# Altium project TMDX654GPEVM.PrjPcb (part 24 of 24)
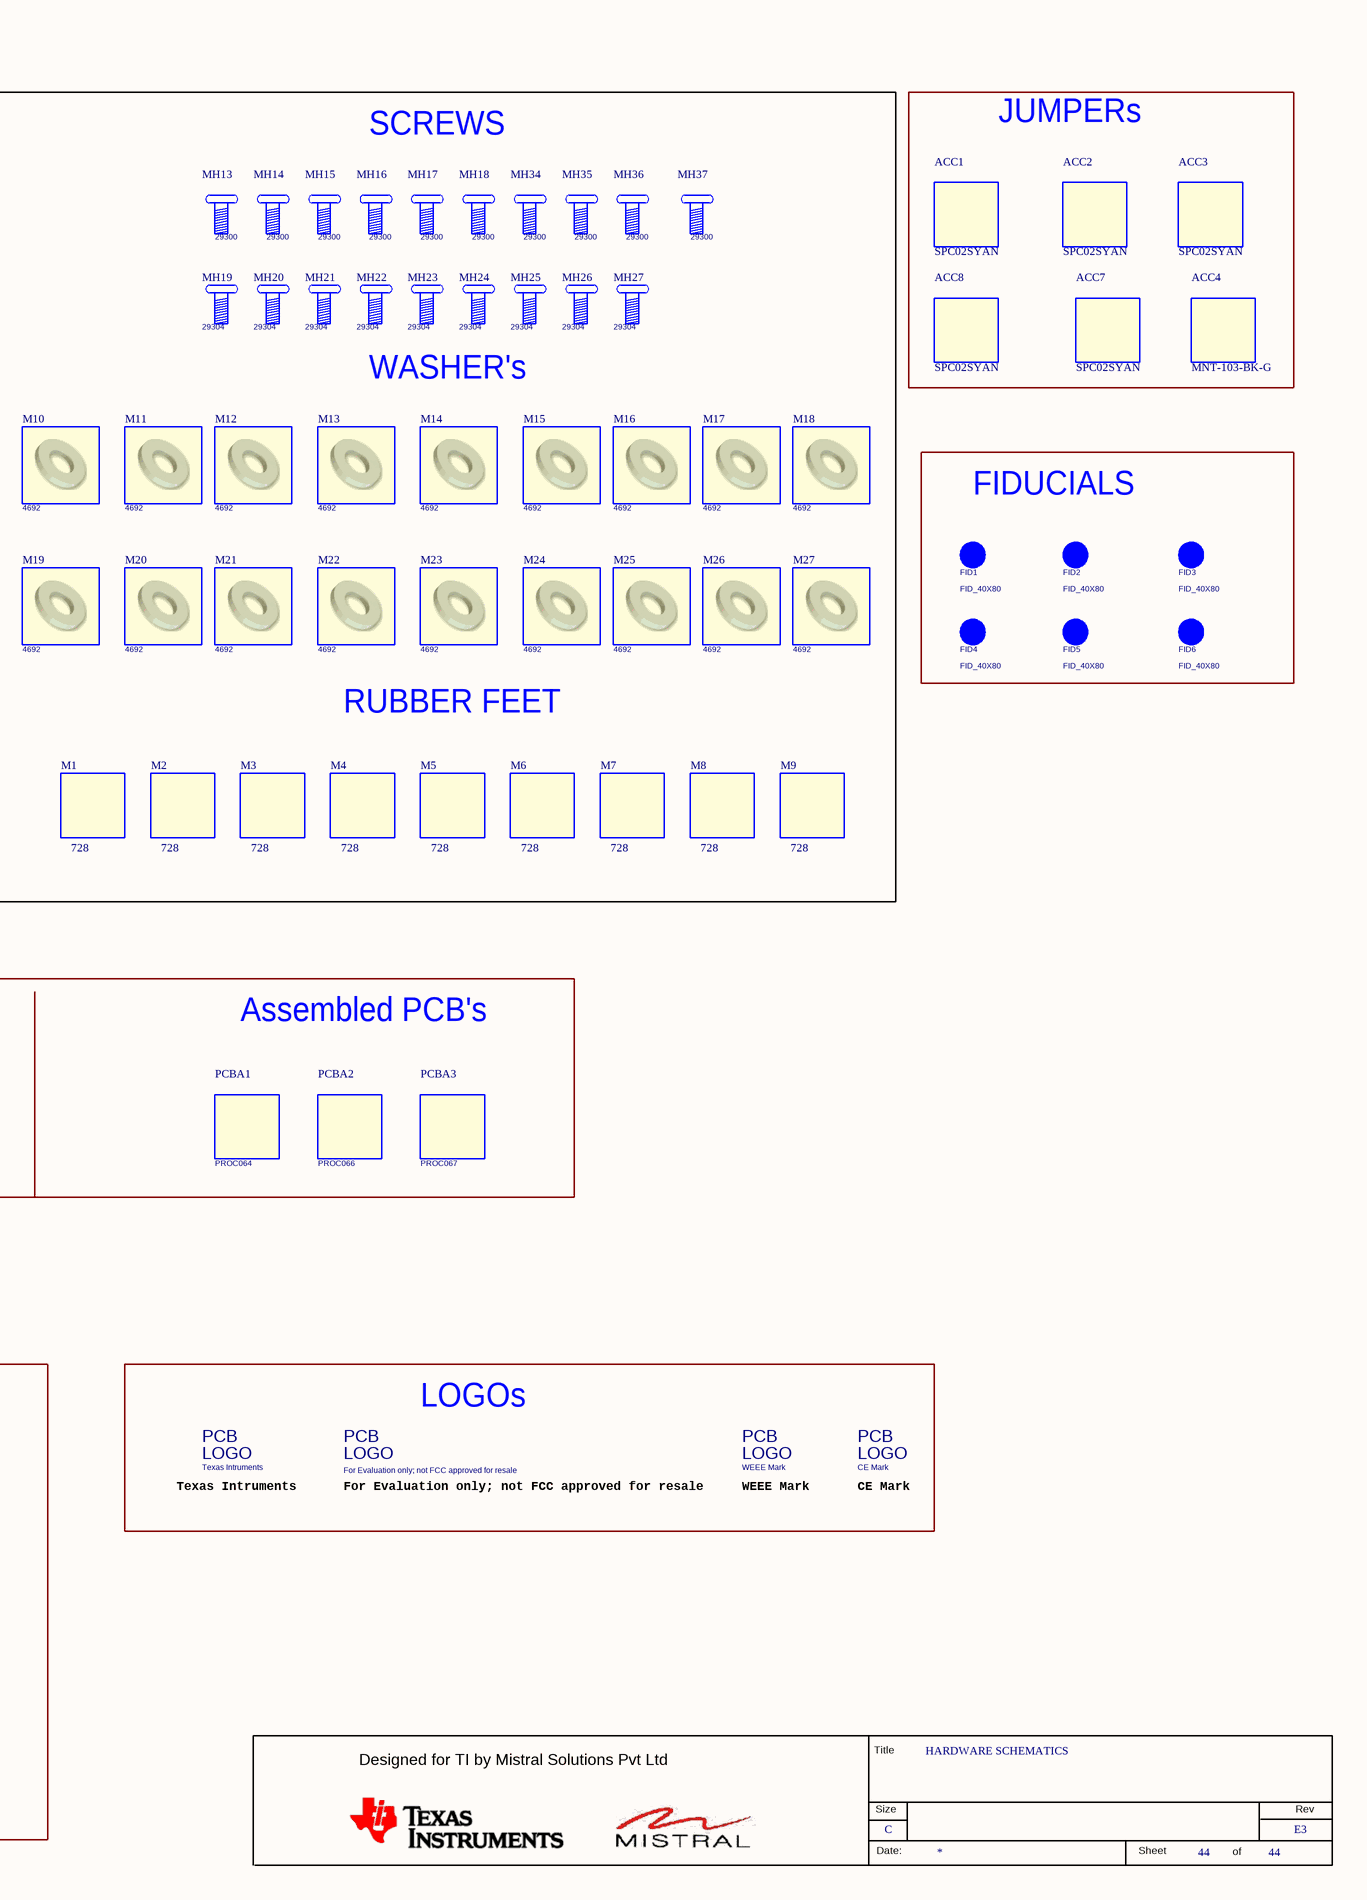
[diagram p84: 44-HARDWARE SCHEMATICS.SchDoc, right]

## Nets that join several sheets
CAP_VDD_WKUP: 11-SoC POWER1 (C115.1 U34.V9), 12-SoC POWER2 (U34.M22 U34.V11 U34.W10 U34.W12), 13-SoC POWER3 (C443.1 C459.1 C475.1 C571.1)
CAP_VDDA_1P8_IOLDO0: 11-SoC POWER1 (C170.2 U34.G19), 12-SoC POWER2 (U34.AA10 U34.AA16 U34.G12 U34.P20)
CAP_VDDA_1P8_IOLDO_WKUP: 11-SoC POWER1 (C113.2 U34.AA8), 12-SoC POWER2 (U34.V8)
CAP_VDDA_1P8_SDIO: 11-SoC POWER1 (C180.1 U34.J17), 12-SoC POWER2 (U34.G17 U34.K20)
CAP_VDDSHV_SDLDO: 11-SoC POWER1 (C541.1 U34.H18), 12-SoC POWER2 (FL20.1)
DDR_VPP: 15-DDR4 DEVICES (20 pins), 16-DDR4 ECC AND TERMINATIONS (6 pins)
DDR_VREFCA: 15-DDR4 DEVICES (12 pins), 16-DDR4 ECC AND TERMINATIONS (C206.1 C597.1 R728.1 U38.J1), 42-PERIPHERAL POWER SUPPLY (C37.1 U10.6)
DGND: 10-SoC CLOCK AND RESET (34 pins), 11-SoC POWER1 (94 pins), 12-SoC POWER2 (R484.2), 13-SoC POWER3 (81 pins), 14-SoC POWER4 (170 pins), 15-DDR4 DEVICES (128 pins), 16-DDR4 ECC AND TERMINATIONS (54 pins), 17-eMMC FLASH_SDCARD INTERFACE (37 pins), 18-OSPI FLASH AND SPI NOR FLASH (14 pins), 19-EEPROM,PRESENCE DETECTION & TEMP SENSOR (26 pins), 20-RGMII ETHERNET PHY - ICSSG PRG2_PRU0 (40 pins), 21-RGMII ETHERNET PHY - ICSSG PRG2_PRU1 (34 pins), 22-RGMII ETHERNET PHY - MCU (48 pins), 23-TEST AUTOMATION (13 pins), 24-BOOT MODE BUFFER AND SWITCHES (54 pins), 25-CURRENT MONITORING DEVICES (31 pins), 26-XDS110 DEBUGGER (57 pins), 27-JTAG BUFFER (32 pins), 28-MIPI 60 PIN CONNECTOR (33 pins), 29-USB 2.0 INTERFACE (17 pins), 30-FT4232 LEVEL TRANSLATOR (51 pins), 31-FT4232 UART TO USB BRIDG (37 pins), 32-APPLICATION BOARD CONNECTOR (74 pins), 33-SOC_GENERAL AND MCU GENERAL (R394.1 R428.2), 34-SERDES AND DISPLAY INTERFACE (62 pins), 35-CSI-GPM-CDSS INTERFACE (75 pins), 36-ETHERNET PHY CLOCK GENERATOR (20 pins), 37-ETHERNET LEDs (23 pins), 38-TEST HEADER (11 pins), 39-VOLTAGE SUPERVISOR AND WKUP LEDs (18 pins), 40-PRE_REG AND SERDES POWER SUPPLY (57 pins), 41-SoC POWER SUPPLY (43 pins), 42-PERIPHERAL POWER SUPPLY (41 pins), 43-OVER VOLTAGE PROTECTION CKT (36 pins)
PRG_EARTH: 20-RGMII ETHERNET PHY - ICSSG PRG2_PRU0 (C489.1 J14.SH1 J14.SH2 R473.1), 21-RGMII ETHERNET PHY - ICSSG PRG2_PRU1 (J14.SH3 J14.SH4)
SOC_DVDD1V8: 12-SoC POWER2 (30 pins), 13-SoC POWER3 (27 pins), 25-CURRENT MONITORING DEVICES (J15.2 R234.3)
SoC_DVDD3V3: 12-SoC POWER2 (21 pins), 13-SoC POWER3 (15 pins), 25-CURRENT MONITORING DEVICES (J31.2 R459.3), 33-SOC_GENERAL AND MCU GENERAL (R395.2)
SoC_MPU: 25-CURRENT MONITORING DEVICES (C278.1 J24.1 R348.4), 41-SoC POWER SUPPLY (C261.1 C266.1 L3.2 TP24.1)
SoC_VDDS_DDR: 11-SoC POWER1 (18 pins), 25-CURRENT MONITORING DEVICES (J29.2 R361.4)
VCC1V0: 25-CURRENT MONITORING DEVICES (6 pins), 41-SoC POWER SUPPLY (9 pins)
VCC1V2_DDR: 25-CURRENT MONITORING DEVICES (6 pins), 41-SoC POWER SUPPLY (5 pins)
VCC1V8: 10-SoC CLOCK AND RESET (6 pins), 17-eMMC FLASH_SDCARD INTERFACE (20 pins), 18-OSPI FLASH AND SPI NOR FLASH (19 pins), 19-EEPROM,PRESENCE DETECTION & TEMP SENSOR (R27.2), 20-RGMII ETHERNET PHY - ICSSG PRG2_PRU0 (22 pins), 21-RGMII ETHERNET PHY - ICSSG PRG2_PRU1 (20 pins), 22-RGMII ETHERNET PHY - MCU (28 pins), 25-CURRENT MONITORING DEVICES (C219.1 J15.1 R234.2), 28-MIPI 60 PIN CONNECTOR (FL5.1), 30-FT4232 LEVEL TRANSLATOR (13 pins), 32-APPLICATION BOARD CONNECTOR (7 pins), 34-SERDES AND DISPLAY INTERFACE (C295.1 C300.1 J6.3), 35-CSI-GPM-CDSS INTERFACE (21 pins), 36-ETHERNET PHY CLOCK GENERATOR (FL4.1), 37-ETHERNET LEDs (C662.1 U109.6), 38-TEST HEADER (6 pins), 41-SoC POWER SUPPLY (5 pins)
VCC3V3_IO: 10-SoC CLOCK AND RESET (11 pins), 17-eMMC FLASH_SDCARD INTERFACE (14 pins), 18-OSPI FLASH AND SPI NOR FLASH (13 pins), 19-EEPROM,PRESENCE DETECTION & TEMP SENSOR (32 pins), 20-RGMII ETHERNET PHY - ICSSG PRG2_PRU0 (R481.2 R482.2 R501.1 R506.2), 21-RGMII ETHERNET PHY - ICSSG PRG2_PRU1 (R178.2 R490.2 R496.1), 22-RGMII ETHERNET PHY - MCU (11 pins), 23-TEST AUTOMATION (14 pins), 24-BOOT MODE BUFFER AND SWITCHES (51 pins), 25-CURRENT MONITORING DEVICES (28 pins), 27-JTAG BUFFER (23 pins), 28-MIPI 60 PIN CONNECTOR (20 pins), 29-USB 2.0 INTERFACE (R37.1), 30-FT4232 LEVEL TRANSLATOR (16 pins), 32-APPLICATION BOARD CONNECTOR (5 pins), 33-SOC_GENERAL AND MCU GENERAL (9 pins), 34-SERDES AND DISPLAY INTERFACE (14 pins), 35-CSI-GPM-CDSS INTERFACE (31 pins), 36-ETHERNET PHY CLOCK GENERATOR (FL3.1), 37-ETHERNET LEDs (20 pins), 38-TEST HEADER (C221.1 R270.2 U45.7), 39-VOLTAGE SUPERVISOR AND WKUP LEDs (5 pins), 41-SoC POWER SUPPLY (R336.2), 42-PERIPHERAL POWER SUPPLY (6 pins)
VCC3V3_PREREG: 12-SoC POWER2 (R486.1), 39-VOLTAGE SUPERVISOR AND WKUP LEDs (C231.1 U49.6), 40-PRE_REG AND SERDES POWER SUPPLY (8 pins), 41-SoC POWER SUPPLY (21 pins), 42-PERIPHERAL POWER SUPPLY (17 pins)
VCC3V3_XDS: 26-XDS110 DEBUGGER (40 pins), 27-JTAG BUFFER (6 pins)
VCC_2V5: 16-DDR4 ECC AND TERMINATIONS (FL1.1), 34-SERDES AND DISPLAY INTERFACE (C297.1 C298.1 J6.1), 42-PERIPHERAL POWER SUPPLY (C17.1 TP82.1 U5.1)
VCC_3V3_FT4232: 30-FT4232 LEVEL TRANSLATOR (8 pins), 31-FT4232 UART TO USB BRIDG (19 pins)
VCC_5V0: 29-USB 2.0 INTERFACE (C50.1 FL2.1), 32-APPLICATION BOARD CONNECTOR (5 pins), 34-SERDES AND DISPLAY INTERFACE (9 pins), 35-CSI-GPM-CDSS INTERFACE (8 pins), 40-PRE_REG AND SERDES POWER SUPPLY (8 pins)
VCC_12V0: 34-SERDES AND DISPLAY INTERFACE (C296.1 C301.1 J6.7 J6.9), 40-PRE_REG AND SERDES POWER SUPPLY (14 pins), 43-OVER VOLTAGE PROTECTION CKT (C336.1 J9.2)
VDD_1V0: 20-RGMII ETHERNET PHY - ICSSG PRG2_PRU0 (13 pins), 21-RGMII ETHERNET PHY - ICSSG PRG2_PRU1 (13 pins), 22-RGMII ETHERNET PHY - MCU (13 pins), 32-APPLICATION BOARD CONNECTOR (C215.1 J16.56 J16.58 J16.60), 34-SERDES AND DISPLAY INTERFACE (C310.1 C314.1 J6.2), 42-PERIPHERAL POWER SUPPLY (6 pins)
VDD_2V5: 20-RGMII ETHERNET PHY - ICSSG PRG2_PRU0 (7 pins), 21-RGMII ETHERNET PHY - ICSSG PRG2_PRU1 (7 pins), 22-RGMII ETHERNET PHY - MCU (7 pins), 32-APPLICATION BOARD CONNECTOR (C609.1 C612.1 J16.52 J16.54), 42-PERIPHERAL POWER SUPPLY (5 pins)
VDD_CORE: 11-SoC POWER1 (71 pins), 12-SoC POWER2 (FL19.1), 25-CURRENT MONITORING DEVICES (J27.2 R355.2), 41-SoC POWER SUPPLY (R339.1)
VDD_DDR4: 15-DDR4 DEVICES (108 pins), 16-DDR4 ECC AND TERMINATIONS (33 pins), 25-CURRENT MONITORING DEVICES (J28.2 R360.1), 42-PERIPHERAL POWER SUPPLY (C22.1 U10.1)
VDD_DLL_CORE: 12-SoC POWER2 (FL19.2 U34.G22 U34.H23), 13-SoC POWER3 (C575.1 C580.1)
VDD_MCU: 11-SoC POWER1 (12 pins), 25-CURRENT MONITORING DEVICES (J26.2 R349.1)
VDD_MPU: 11-SoC POWER1 (30 pins), 25-CURRENT MONITORING DEVICES (J24.2 R348.1), 39-VOLTAGE SUPERVISOR AND WKUP LEDs (R476.1), 41-SoC POWER SUPPLY (U59.B1)
VDDA1V8: 25-CURRENT MONITORING DEVICES (C263.1 J25.1 R342.2), 41-SoC POWER SUPPLY (C259.1 TP22.1 U60.1)
VDDA_1P8_OLDI: 12-SoC POWER2 (FL21.2 U34.L22), 13-SoC POWER3 (C566.1)
VDDA_1V8: 12-SoC POWER2 (17 pins), 25-CURRENT MONITORING DEVICES (J25.2 R342.3)
VDDA_3P3_IOLDO_WKUP: 12-SoC POWER2 (FL16.2 U34.AB9), 13-SoC POWER3 (C450.1)
VDDA_3P3_USB: 12-SoC POWER2 (FL18.2 U34.AC12), 13-SoC POWER3 (C464.1 C501.1)
VDDA_GP1: 12-SoC POWER2 (FL27.2 U34.AA14 U34.AB13 U34.AB15), 13-SoC POWER3 (C478.1 C495.1 C521.1)
VDDA_GP3: 12-SoC POWER2 (FL30.2 U34.U12), 13-SoC POWER3 (C472.1)
VDDA_GP4: 12-SoC POWER2 (FL28.2 U34.L20 U34.M21), 13-SoC POWER3 (C556.1 C595.1)
VDDA_GP9: 12-SoC POWER2 (FL29.2 U34.AA9), 13-SoC POWER3 (C448.1)
VDDA_MCU_ADC: 12-SoC POWER2 (FL26.2 U34.M7 U34.M9), 13-SoC POWER3 (C423.1 C444.1)
VDDA_PLL_DDR: 12-SoC POWER2 (FL32.2 U34.H11 U34.H15), 13-SoC POWER3 (C455.1 C507.1)
VDDA_PLL_DSS: 12-SoC POWER2 (FL33.2 U34.L21), 13-SoC POWER3 (C565.1)
VDDA_PLL_MAIN: 12-SoC POWER2 (FL34.2 U34.Y17), 13-SoC POWER3 (C527.1)
VDDA_PLL_MPU: 12-SoC POWER2 (FL31.2 U34.K15 U34.L12), 13-SoC POWER3 (C474.1 C508.1)
VDDA_PLL_PER0: 12-SoC POWER2 (FL35.2 U34.AB7), 13-SoC POWER3 (C422.1)
VDDA_POR: 12-SoC POWER2 (FL24.2 U34.Y9), 13-SoC POWER3 (C445.1)
VDDA_SRAM_CORE: 12-SoC POWER2 (FL22.2 U34.M19 U34.V16), 13-SoC POWER3 (C519.1 C546.1)
VDDA_SRAM_MPU: 12-SoC POWER2 (FL23.2 U34.K7 U34.L18), 13-SoC POWER3 (C419.1 C540.1)
VDDA_WKUP_LDO: 12-SoC POWER2 (FL25.2 U34.AB8), 13-SoC POWER3 (C430.1)
VDDR_VTT: 16-DDR4 ECC AND TERMINATIONS (45 pins), 42-PERIPHERAL POWER SUPPLY (C38.2 TP5.1 U10.3 U10.5)
VDDS_OSC1: 12-SoC POWER2 (FL36.2 U34.J16), 13-SoC POWER3 (C514.1 C522.1)
VDDSHV_MMC1: 12-SoC POWER2 (5 pins), 13-SoC POWER3 (C552.1 C564.2 C572.1)
VDDSHV_SD_IO: 12-SoC POWER2 (FL37.2), 17-eMMC FLASH_SDCARD INTERFACE (9 pins), 38-TEST HEADER (C607.1 R600.2 U96.7)
VMAIN: 39-VOLTAGE SUPERVISOR AND WKUP LEDs (C179.1 R200.1 U35.5), 40-PRE_REG AND SERDES POWER SUPPLY (17 pins), 42-PERIPHERAL POWER SUPPLY (C323.1 C341.1 U80.1), 43-OVER VOLTAGE PROTECTION CKT (6 pins)
VPP_1V8: 12-SoC POWER2 (FL17.1), 41-SoC POWER SUPPLY (C5.1 TP23.1 U1.1)
VPP_CORE_MCU: 12-SoC POWER2 (FL17.2 U34.F21 U34.T6), 13-SoC POWER3 (C414.1 C559.1)
APP_CARD_PSTN: 19-EEPROM,PRESENCE DETECTION & TEMP SENSOR (R238.1 U46.4), 32-APPLICATION BOARD CONNECTOR (J18.113)
APP_UART1_CTS: 30-FT4232 LEVEL TRANSLATOR (U26.13), 32-APPLICATION BOARD CONNECTOR (J16.27)
APP_UART1_RTS: 30-FT4232 LEVEL TRANSLATOR (U26.10), 32-APPLICATION BOARD CONNECTOR (J16.29)
APP_UART1_RX: 30-FT4232 LEVEL TRANSLATOR (U26.6), 32-APPLICATION BOARD CONNECTOR (J16.31)
APP_UART1_TX: 30-FT4232 LEVEL TRANSLATOR (U26.3), 32-APPLICATION BOARD CONNECTOR (J16.33)
BOOTMODE_I2C_SCL: 23-TEST AUTOMATION (J41.37 R696.2), 24-BOOT MODE BUFFER AND SWITCHES (U99.29)
BOOTMODE_I2C_SDA: 23-TEST AUTOMATION (J41.39 R697.2), 24-BOOT MODE BUFFER AND SWITCHES (U99.30)
CON_LCD_PWR_DN: 35-CSI-GPM-CDSS INTERFACE (J35.40 J36.40), 37-ETHERNET LEDs (U110.7)
DDR_A14_WEn: 15-DDR4 DEVICES (U16.H2 U20.H2 U25.H2 U33.H2), 16-DDR4 ECC AND TERMINATIONS (R382.1 U34.C6 U38.H2)
DDR_A15_CAS: 15-DDR4 DEVICES (U16.H7 U20.H7 U25.H7 U33.H7), 16-DDR4 ECC AND TERMINATIONS (R46.1 U34.F6 U38.H7)
DDR_A16_RAS: 15-DDR4 DEVICES (U16.H8 U20.H8 U25.H8 U33.H8), 16-DDR4 ECC AND TERMINATIONS (R371.1 U34.E6 U38.H8)
DDR_A17: 15-DDR4 DEVICES (U16.N7 U20.N7 U25.N7 U33.N7), 16-DDR4 ECC AND TERMINATIONS (R366.1 U34.E5 U38.N7)
DDR_ACTn: 15-DDR4 DEVICES (U16.H3 U20.H3 U25.H3 U33.H3), 16-DDR4 ECC AND TERMINATIONS (R742.1 U34.D8 U38.H3)
DDR_ALERTn: 15-DDR4 DEVICES (U16.L9 U20.L9 U25.L9 U33.L9), 16-DDR4 ECC AND TERMINATIONS (R460.1 U34.D5 U38.L9)
DDR_BA0: 15-DDR4 DEVICES (U16.K2 U20.K2 U25.K2 U33.K2), 16-DDR4 ECC AND TERMINATIONS (R63.1 U34.D10 U38.K2)
DDR_BA1: 15-DDR4 DEVICES (U16.K8 U20.K8 U25.K8 U33.K8), 16-DDR4 ECC AND TERMINATIONS (R48.1 U34.E10 U38.K8)
DDR_BG0: 15-DDR4 DEVICES (U16.J2 U20.J2 U25.J2 U33.J2), 16-DDR4 ECC AND TERMINATIONS (R61.1 U34.C10 U38.J2)
DDR_BG1: 15-DDR4 DEVICES (U16.J8 U20.J8 U25.J8 U33.J8), 16-DDR4 ECC AND TERMINATIONS (R47.1 U34.F11 U38.J8)
DDR_CKE: 15-DDR4 DEVICES (U16.G3 U20.G3 U25.G3 U33.G3), 16-DDR4 ECC AND TERMINATIONS (R57.1 R731.1 U34.C11 U38.G3)
DDR_CKE1: 15-DDR4 DEVICES (U16.G2 U20.G2 U25.G2 U33.G2), 16-DDR4 ECC AND TERMINATIONS (R379.1 R730.1 U34.D12 U38.G2)
DDR_CLKN: 15-DDR4 DEVICES (U16.F8 U20.F8 U25.F8 U33.F8), 16-DDR4 ECC AND TERMINATIONS (R374.1 U34.B8 U38.F8)
DDR_CLKP: 15-DDR4 DEVICES (U16.F7 U20.F7 U25.F7 U33.F7), 16-DDR4 ECC AND TERMINATIONS (R373.1 U34.A8 U38.F7)
DDR_CS1n: 15-DDR4 DEVICES (U16.G8 U20.G8 U25.G8 U33.G8), 16-DDR4 ECC AND TERMINATIONS (R45.1 U34.E11 U38.G8)
DDR_CSn: 15-DDR4 DEVICES (U16.G7 U20.G7 U25.G7 U33.G7), 16-DDR4 ECC AND TERMINATIONS (R372.1 U34.D11 U38.G7)
DDR_DM0: 15-DDR4 DEVICES (U16.A7), 16-DDR4 ECC AND TERMINATIONS (U34.E1)
DDR_DM1: 15-DDR4 DEVICES (U20.A7), 16-DDR4 ECC AND TERMINATIONS (U34.C5)
DDR_DM2: 15-DDR4 DEVICES (U25.A7), 16-DDR4 ECC AND TERMINATIONS (U34.D14)
DDR_DM3: 15-DDR4 DEVICES (U33.A7), 16-DDR4 ECC AND TERMINATIONS (U34.B17)
DDR_DQS0_N: 15-DDR4 DEVICES (U16.B3), 16-DDR4 ECC AND TERMINATIONS (U34.C1)
DDR_DQS0_P: 15-DDR4 DEVICES (U16.C3), 16-DDR4 ECC AND TERMINATIONS (U34.D1)
DDR_DQS1_N: 15-DDR4 DEVICES (U20.B3), 16-DDR4 ECC AND TERMINATIONS (U34.A4)
DDR_DQS1_P: 15-DDR4 DEVICES (U20.C3), 16-DDR4 ECC AND TERMINATIONS (U34.A5)
DDR_DQS2_N: 15-DDR4 DEVICES (U25.B3), 16-DDR4 ECC AND TERMINATIONS (U34.A12)
DDR_DQS2_P: 15-DDR4 DEVICES (U25.C3), 16-DDR4 ECC AND TERMINATIONS (U34.A13)
DDR_DQS3_N: 15-DDR4 DEVICES (U33.B3), 16-DDR4 ECC AND TERMINATIONS (U34.A16)
DDR_DQS3_P: 15-DDR4 DEVICES (U33.C3), 16-DDR4 ECC AND TERMINATIONS (U34.A15)
DDR_ODT: 15-DDR4 DEVICES (U16.F3 U20.F3 U25.F3 U33.F3), 16-DDR4 ECC AND TERMINATIONS (R377.1 U34.B11 U38.F3)
DDR_ODT1: 15-DDR4 DEVICES (U16.F2 U20.F2 U25.F2 U33.F2), 16-DDR4 ECC AND TERMINATIONS (R56.1 U34.E12 U38.F2)
DDR_PARITY: 15-DDR4 DEVICES (U16.N3 U20.N3 U25.N3 U33.N3), 16-DDR4 ECC AND TERMINATIONS (R391.1 U34.B10 U38.N3)
DDR_RESET#: 15-DDR4 DEVICES (U16.L1 U20.L1 U25.L1 U33.L1), 16-DDR4 ECC AND TERMINATIONS (5 pins)
DDR_TEN: 15-DDR4 DEVICES (U16.G9 U20.G9 U25.G9 U33.G9), 16-DDR4 ECC AND TERMINATIONS (R462.2 R503.1 U38.G9)
DDR_VTT_EN: 18-OSPI FLASH AND SPI NOR FLASH (U34.P3), 37-ETHERNET LEDs (R707.1 U109.4)
DDR_VTT_EN_3V3: 37-ETHERNET LEDs (U109.9), 42-PERIPHERAL POWER SUPPLY (R41.1 TP84.1 U10.7 U10.9)
ECAP0_IN_APWM0_OUT: 33-SOC_GENERAL AND MCU GENERAL (U34.D21), 34-SERDES AND DISPLAY INTERFACE (J38.38)
EXP_PCIe_DET_INTn: 18-OSPI FLASH AND SPI NOR FLASH (U34.T1), 19-EEPROM,PRESENCE DETECTION & TEMP SENSOR (R27.1 U7.13)
FT4232_MCU_UART1_CTS_3V3: 30-FT4232 LEVEL TRANSLATOR (U12.12), 31-FT4232 UART TO USB BRIDG (U73.28)
FT4232_MCU_UART1_RTS_3V3: 30-FT4232 LEVEL TRANSLATOR (U12.14), 31-FT4232 UART TO USB BRIDG (U73.29)
FT4232_MCU_UART1_RX_3V3: 30-FT4232 LEVEL TRANSLATOR (U12.13), 31-FT4232 UART TO USB BRIDG (U73.26)
FT4232_MCU_UART1_TX_3V3: 30-FT4232 LEVEL TRANSLATOR (U12.15), 31-FT4232 UART TO USB BRIDG (U73.27)
FT4232_UART0_CTS_3V3: 30-FT4232 LEVEL TRANSLATOR (U19.12), 31-FT4232 UART TO USB BRIDG (U73.18)
FT4232_UART0_RTS_3V3: 30-FT4232 LEVEL TRANSLATOR (U19.14), 31-FT4232 UART TO USB BRIDG (U73.19)
FT4232_UART0_RX_3V3: 30-FT4232 LEVEL TRANSLATOR (U19.13), 31-FT4232 UART TO USB BRIDG (U73.16)
FT4232_UART0_TX_3V3: 30-FT4232 LEVEL TRANSLATOR (U19.15), 31-FT4232 UART TO USB BRIDG (U73.17)
FT4232_UART1_CTS_3V3: 30-FT4232 LEVEL TRANSLATOR (U85.12), 31-FT4232 UART TO USB BRIDG (U73.53)
FT4232_UART1_RTS_3V3: 30-FT4232 LEVEL TRANSLATOR (U85.14), 31-FT4232 UART TO USB BRIDG (U73.54)
FT4232_UART1_RX_3V3: 30-FT4232 LEVEL TRANSLATOR (U85.13), 31-FT4232 UART TO USB BRIDG (U73.48)
FT4232_UART1_TX_3V3: 30-FT4232 LEVEL TRANSLATOR (U85.15), 31-FT4232 UART TO USB BRIDG (U73.52)
FT4232_WKUP_UART0_CTS_3V3: 30-FT4232 LEVEL TRANSLATOR (U21.12), 31-FT4232 UART TO USB BRIDG (U73.40)
FT4232_WKUP_UART0_RTS_3V3: 30-FT4232 LEVEL TRANSLATOR (U21.14), 31-FT4232 UART TO USB BRIDG (U73.41)
FT4232_WKUP_UART0_RX_3V3: 30-FT4232 LEVEL TRANSLATOR (U21.13), 31-FT4232 UART TO USB BRIDG (U73.38)
FT4232_WKUP_UART0_TX_3V3: 30-FT4232 LEVEL TRANSLATOR (U21.15), 31-FT4232 UART TO USB BRIDG (U73.39)
GP1_TOUCH_EVT: 35-CSI-GPM-CDSS INTERFACE (J35.38 J36.38), 37-ETHERNET LEDs (U110.13)
GPIO_CSI_RESETn: 35-CSI-GPM-CDSS INTERFACE (R658.1 U108.1), 37-ETHERNET LEDs (U110.8)
GPIO_eMMC_RSTn: 17-eMMC FLASH_SDCARD INTERFACE (R303.1 U48.1), 37-ETHERNET LEDs (U110.1)
GPIO_MCU_RGMII_RSTN: 22-RGMII ETHERNET PHY - MCU (R409.2 R412.1 U82.1), 37-ETHERNET LEDs (U110.5)
GPIO_OSPI_RSTn: 18-OSPI FLASH AND SPI NOR FLASH (R390.1 U74.1), 37-ETHERNET LEDs (U110.2)
GPIO_PRG2_RGMII_RESETn: 20-RGMII ETHERNET PHY - ICSSG PRG2_PRU0 (R506.1 R513.2 U86.1), 37-ETHERNET LEDs (U110.4)
GPIO_SGMII_PHY_INT: 33-SOC_GENERAL AND MCU GENERAL (R729.2), 34-SERDES AND DISPLAY INTERFACE (J5.46 R58.1)
GPIO_SGMII_PHY_RST: 34-SERDES AND DISPLAY INTERFACE (J5.6), 37-ETHERNET LEDs (U110.6)
GPIO_SPI0_RSTn: 18-OSPI FLASH AND SPI NOR FLASH (R159.1 U28.1), 37-ETHERNET LEDs (U110.3)
HDMI_GPMC_BRD_DET: 19-EEPROM,PRESENCE DETECTION & TEMP SENSOR (R235.1 U46.7), 35-CSI-GPM-CDSS INTERFACE (J35.18 J36.18)
HDR_MCU_UART1_CTS_3V3: 30-FT4232 LEVEL TRANSLATOR (U6.12), 38-TEST HEADER (J30.6)
HDR_MCU_UART1_RTS_3V3: 30-FT4232 LEVEL TRANSLATOR (U6.14), 38-TEST HEADER (J30.2)
HDR_MCU_UART1_RX_3V3: 30-FT4232 LEVEL TRANSLATOR (U6.13), 38-TEST HEADER (J30.4)
HDR_MCU_UART1_TX_3V3: 30-FT4232 LEVEL TRANSLATOR (U6.15), 38-TEST HEADER (J30.5)
HDR_WKUP_UART0_CTS_3V3: 30-FT4232 LEVEL TRANSLATOR (U23.1), 38-TEST HEADER (J11.6)
HDR_WKUP_UART0_RX_3V3: 30-FT4232 LEVEL TRANSLATOR (U83.1), 38-TEST HEADER (J11.4)
JTAG_EMU0: 27-JTAG BUFFER (R504.2 U87.8), 28-MIPI 60 PIN CONNECTOR (J13.13 U37.8)
JTAG_EMU1: 27-JTAG BUFFER (R521.2 U87.1), 28-MIPI 60 PIN CONNECTOR (J13.14 U37.1)
JTAG_EMU_RSTn: 28-MIPI 60 PIN CONNECTOR (J13.15 R213.2 R472.1), 39-VOLTAGE SUPERVISOR AND WKUP LEDs (U50.6)
JTAG_TCK: 27-JTAG BUFFER (U43.12), 28-MIPI 60 PIN CONNECTOR (U42.4)
JTAG_TDI: 27-JTAG BUFFER (U43.13), 28-MIPI 60 PIN CONNECTOR (J13.3 R196.2)
JTAG_TDO: 27-JTAG BUFFER (U101.7), 28-MIPI 60 PIN CONNECTOR (J13.7 R202.1)
JTAG_TMS: 27-JTAG BUFFER (U43.11), 28-MIPI 60 PIN CONNECTOR (J13.1 R470.1)
JTAG_TRST#: 27-JTAG BUFFER (U43.10), 28-MIPI 60 PIN CONNECTOR (J13.2 R475.1)
LCD_BRD_DET: 19-EEPROM,PRESENCE DETECTION & TEMP SENSOR (R237.1 U46.5), 34-SERDES AND DISPLAY INTERFACE (J38.40)
LCD_BRD_TOUCH_INT: 19-EEPROM,PRESENCE DETECTION & TEMP SENSOR (R36.1 U7.7), 34-SERDES AND DISPLAY INTERFACE (J38.29)
LCD_BRD_TOUCH_RESETn: 34-SERDES AND DISPLAY INTERFACE (R686.1 U113.1), 37-ETHERNET LEDs (U110.11)
LCD_DISPLAY_EN: 34-SERDES AND DISPLAY INTERFACE (J38.30 R687.2), 37-ETHERNET LEDs (U110.10)
MAIN_UART1_SEL: 30-FT4232 LEVEL TRANSLATOR (R134.2 U26.1), 37-ETHERNET LEDs (U110.15)
MCASP1_ACLKR: 32-APPLICATION BOARD CONNECTOR (R577.2), 35-CSI-GPM-CDSS INTERFACE (U100.7)
MCASP1_ACLKX: 32-APPLICATION BOARD CONNECTOR (R575.2), 35-CSI-GPM-CDSS INTERFACE (U100.4)
MCASP1_AFSR: 32-APPLICATION BOARD CONNECTOR (R573.2), 35-CSI-GPM-CDSS INTERFACE (U100.8)
MCASP1_AFSX: 32-APPLICATION BOARD CONNECTOR (R579.2), 35-CSI-GPM-CDSS INTERFACE (U100.1)
MCASP1_AHCLKR: 32-APPLICATION BOARD CONNECTOR (R569.2), 35-CSI-GPM-CDSS INTERFACE (U100.9)
MCASP1_AHCLKX: 32-APPLICATION BOARD CONNECTOR (R590.2), 35-CSI-GPM-CDSS INTERFACE (U100.5)
MCASP1_AXR0: 32-APPLICATION BOARD CONNECTOR (R571.2), 35-CSI-GPM-CDSS INTERFACE (U100.6)
MCASP1_AXR1: 32-APPLICATION BOARD CONNECTOR (R588.2), 35-CSI-GPM-CDSS INTERFACE (U100.3)
MCU_BOOTMODE0: 24-BOOT MODE BUFFER AND SWITCHES (R228.1 R231.2), 33-SOC_GENERAL AND MCU GENERAL (U34.AF4), 37-ETHERNET LEDs (R225.2)
MCU_BOOTMODE1: 24-BOOT MODE BUFFER AND SWITCHES (R540.2 R546.1), 33-SOC_GENERAL AND MCU GENERAL (U34.AF3), 37-ETHERNET LEDs (R548.2)
MCU_BOOTMODE2: 24-BOOT MODE BUFFER AND SWITCHES (R230.1 R232.2), 33-SOC_GENERAL AND MCU GENERAL (U34.AE3)
MCU_BOOTMODE3: 24-BOOT MODE BUFFER AND SWITCHES (R301.1 SW4.1), 33-SOC_GENERAL AND MCU GENERAL (U34.AD1)
MCU_BOOTMODE9: 24-BOOT MODE BUFFER AND SWITCHES (R83.1 R84.2), 33-SOC_GENERAL AND MCU GENERAL (U34.AB4)
MCU_CLKOUT: 33-SOC_GENERAL AND MCU GENERAL (R129.2), 36-ETHERNET PHY CLOCK GENERATOR (R185.2 R190.1 U32.13)
MCU_ETH1_INTn: 22-RGMII ETHERNET PHY - MCU (R100.1 U22.44), 38-TEST HEADER (U96.5)
MCU_ETH1_INTn_SDIO: 17-eMMC FLASH_SDCARD INTERFACE (U34.C24), 38-TEST HEADER (R600.1 U96.8)
MCU_MCAN0_RX: 32-APPLICATION BOARD CONNECTOR (J16.32), 33-SOC_GENERAL AND MCU GENERAL (U34.W2)
MCU_MCAN0_TX: 32-APPLICATION BOARD CONNECTOR (J16.30), 33-SOC_GENERAL AND MCU GENERAL (R131.1)
MCU_MCAN1_RX: 32-APPLICATION BOARD CONNECTOR (J16.36), 33-SOC_GENERAL AND MCU GENERAL (U34.AD3)
MCU_MCAN1_TX: 32-APPLICATION BOARD CONNECTOR (J16.34), 33-SOC_GENERAL AND MCU GENERAL (R128.2)
MCU_MCAN1_TX/BOOTMODE4: 24-BOOT MODE BUFFER AND SWITCHES (R305.1 SW4.2), 33-SOC_GENERAL AND MCU GENERAL (R128.1 U34.AC3)
MCU_MDC_RGMII_3V3: 22-RGMII ETHERNET PHY - MCU (R175.2 U29.5), 33-SOC_GENERAL AND MCU GENERAL (R132.1)
MCU_MDIO_3V3: 22-RGMII ETHERNET PHY - MCU (R174.2 U30.8), 33-SOC_GENERAL AND MCU GENERAL (U34.L4)
MCU_PORz_OUT: 22-RGMII ETHERNET PHY - MCU (R415.1 U82.2), 33-SOC_GENERAL AND MCU GENERAL (TP85.1 U34.V2)
MCU_RGMII1_CLKIN: 22-RGMII ETHERNET PHY - MCU (U22.15), 36-ETHERNET PHY CLOCK GENERATOR (R203.2)
MCU_SPI0_CLK: 33-SOC_GENERAL AND MCU GENERAL (R432.1), 35-CSI-GPM-CDSS INTERFACE (U111.16)
MCU_SPI0_CLK/BOOTMODE6: 24-BOOT MODE BUFFER AND SWITCHES (R441.1 R442.2), 33-SOC_GENERAL AND MCU GENERAL (R432.2 U34.Y1)
MCU_SPI0_CS0: 33-SOC_GENERAL AND MCU GENERAL (U34.Y4), 35-CSI-GPM-CDSS INTERFACE (U111.15)
MCU_SPI0_D0/BOOTMODE7: 24-BOOT MODE BUFFER AND SWITCHES (R668.1 R669.2), 33-SOC_GENERAL AND MCU GENERAL (U34.Y3), 35-CSI-GPM-CDSS INTERFACE (U111.17)
MCU_UART_SEL: 30-FT4232 LEVEL TRANSLATOR (R32.1 U8.6 U65.6), 37-ETHERNET LEDs (U109.5)
MMC1_SD_EN: 17-eMMC FLASH_SDCARD INTERFACE (R735.2 U115.4), 19-EEPROM,PRESENCE DETECTION & TEMP SENSOR (U7.9)
OSC1_XI: 10-SoC CLOCK AND RESET (R507.1), 33-SOC_GENERAL AND MCU GENERAL (U34.C22)
OSC1_XOUT: 10-SoC CLOCK AND RESET (R511.1), 33-SOC_GENERAL AND MCU GENERAL (U34.E22)
OSPI_LBCLKO_GPIO: 18-OSPI FLASH AND SPI NOR FLASH (U34.U1), 34-SERDES AND DISPLAY INTERFACE (R705.2)
PCIe0_PRSNTn: 19-EEPROM,PRESENCE DETECTION & TEMP SENSOR (R26.1 U7.4), 34-SERDES AND DISPLAY INTERFACE (J5.21)
PCIe1_PRSNTn: 19-EEPROM,PRESENCE DETECTION & TEMP SENSOR (R29.1 U7.5), 34-SERDES AND DISPLAY INTERFACE (J5.22)
PORz_OUT: 17-eMMC FLASH_SDCARD INTERFACE (R304.1 U48.2), 18-OSPI FLASH AND SPI NOR FLASH (U28.2 U74.2), 20-RGMII ETHERNET PHY - ICSSG PRG2_PRU0 (U86.2), 24-BOOT MODE BUFFER AND SWITCHES (U17.2), 32-APPLICATION BOARD CONNECTOR (J16.38), 33-SOC_GENERAL AND MCU GENERAL (TP86.1 U34.C19), 34-SERDES AND DISPLAY INTERFACE (J5.30 U113.2), 35-CSI-GPM-CDSS INTERFACE (J35.16 J36.16 U108.2)
PRG0_RGMII1_ETH1_CLK: 32-APPLICATION BOARD CONNECTOR (J18.4), 36-ETHERNET PHY CLOCK GENERATOR (R204.2)
PRG0_RGMII2_ETH2_CLK: 32-APPLICATION BOARD CONNECTOR (J18.106), 36-ETHERNET PHY CLOCK GENERATOR (R205.2)
PRG1_RGMII1_ETH1_CLK: 32-APPLICATION BOARD CONNECTOR (J18.3), 36-ETHERNET PHY CLOCK GENERATOR (R206.2)
PRG1_RGMII2_ETH2_CLK: 32-APPLICATION BOARD CONNECTOR (J18.103), 36-ETHERNET PHY CLOCK GENERATOR (R207.2)
PRG2_ETH1_LED_LINK/MCUBOOTMODE5: 20-RGMII ETHERNET PHY - ICSSG PRG2_PRU0 (U31.47), 24-BOOT MODE BUFFER AND SWITCHES (R87.2 R88.1), 33-SOC_GENERAL AND MCU GENERAL (U34.Y2)
PRG2_ETH2_LED_LINK/MCUBOOTMODE8: 21-RGMII ETHERNET PHY - ICSSG PRG2_PRU1 (U88.47), 24-BOOT MODE BUFFER AND SWITCHES (R81.1 R82.2), 33-SOC_GENERAL AND MCU GENERAL (U34.AC5)
PRG2_ETH_LED0: 19-EEPROM,PRESENCE DETECTION & TEMP SENSOR (U7.10), 37-ETHERNET LEDs (R464.2 R737.2)
PRG2_ETH_LED1: 19-EEPROM,PRESENCE DETECTION & TEMP SENSOR (U7.11), 37-ETHERNET LEDs (R458.2 R738.2)
PRG2_MDC: 20-RGMII ETHERNET PHY - ICSSG PRG2_PRU0 (U31.16), 21-RGMII ETHERNET PHY - ICSSG PRG2_PRU1 (U88.16), 28-MIPI 60 PIN CONNECTOR (RA5.16), 34-SERDES AND DISPLAY INTERFACE (J5.16)
PRG2_MDIO: 20-RGMII ETHERNET PHY - ICSSG PRG2_PRU0 (R198.1 U31.17), 21-RGMII ETHERNET PHY - ICSSG PRG2_PRU1 (R498.1 U88.17), 28-MIPI 60 PIN CONNECTOR (RA3.11), 34-SERDES AND DISPLAY INTERFACE (J5.15)
PRG2_PRU0_GP0: 20-RGMII ETHERNET PHY - ICSSG PRG2_PRU0 (U34.AF18), 28-MIPI 60 PIN CONNECTOR (RA1.4 RA9.5)
PRG2_PRU0_GP1: 20-RGMII ETHERNET PHY - ICSSG PRG2_PRU0 (U34.AE18), 28-MIPI 60 PIN CONNECTOR (RA1.5 RA9.4)
PRG2_PRU0_GP2: 20-RGMII ETHERNET PHY - ICSSG PRG2_PRU0 (U34.AH17), 28-MIPI 60 PIN CONNECTOR (RA1.3 RA9.6)
PRG2_PRU0_GP3: 20-RGMII ETHERNET PHY - ICSSG PRG2_PRU0 (U34.AG18), 28-MIPI 60 PIN CONNECTOR (RA1.2 RA9.7)
PRG2_PRU0_GP4: 20-RGMII ETHERNET PHY - ICSSG PRG2_PRU0 (U34.AG17), 28-MIPI 60 PIN CONNECTOR (RA1.1 RA9.8)
PRG2_PRU0_GP5: 20-RGMII ETHERNET PHY - ICSSG PRG2_PRU0 (U34.AF17), 28-MIPI 60 PIN CONNECTOR (RA3.8 RA10.1)
PRG2_PRU0_GP6: 20-RGMII ETHERNET PHY - ICSSG PRG2_PRU0 (R209.2), 28-MIPI 60 PIN CONNECTOR (RA3.7 RA10.2)
PRG2_PRU0_GP7: 20-RGMII ETHERNET PHY - ICSSG PRG2_PRU0 (U34.AC19), 28-MIPI 60 PIN CONNECTOR (RA3.6 RA10.3)
PRG2_PRU0_GP8: 20-RGMII ETHERNET PHY - ICSSG PRG2_PRU0 (R211.2), 28-MIPI 60 PIN CONNECTOR (RA3.5 RA10.4)
PRG2_PRU0_GP9: 20-RGMII ETHERNET PHY - ICSSG PRG2_PRU0 (RA4.4), 28-MIPI 60 PIN CONNECTOR (RA3.4 RA10.5)
PRG2_PRU0_GP10: 20-RGMII ETHERNET PHY - ICSSG PRG2_PRU0 (RA4.3), 28-MIPI 60 PIN CONNECTOR (RA3.3 RA10.6)
PRG2_PRU0_GP11: 20-RGMII ETHERNET PHY - ICSSG PRG2_PRU0 (RA4.2), 28-MIPI 60 PIN CONNECTOR (RA3.2 RA10.7)
PRG2_PRU0_GP16: 20-RGMII ETHERNET PHY - ICSSG PRG2_PRU0 (RA4.1), 28-MIPI 60 PIN CONNECTOR (RA3.1 RA10.8)
PRG2_PRU1_GP0: 20-RGMII ETHERNET PHY - ICSSG PRG2_PRU0 (U34.AH15), 28-MIPI 60 PIN CONNECTOR (RA5.8 RA11.1)
PRG2_PRU1_GP1: 20-RGMII ETHERNET PHY - ICSSG PRG2_PRU0 (U34.AC16), 28-MIPI 60 PIN CONNECTOR (RA5.7 RA11.2)
PRG2_PRU1_GP2: 20-RGMII ETHERNET PHY - ICSSG PRG2_PRU0 (U34.AD17), 28-MIPI 60 PIN CONNECTOR (RA5.6 RA11.3)
PRG2_PRU1_GP3: 20-RGMII ETHERNET PHY - ICSSG PRG2_PRU0 (U34.AH14), 28-MIPI 60 PIN CONNECTOR (RA5.5 RA11.4)
PRG2_PRU1_GP4: 20-RGMII ETHERNET PHY - ICSSG PRG2_PRU0 (U34.AG14), 28-MIPI 60 PIN CONNECTOR (RA5.4 RA11.5)
PRG2_PRU1_GP5: 20-RGMII ETHERNET PHY - ICSSG PRG2_PRU0 (U34.AG15), 28-MIPI 60 PIN CONNECTOR (RA5.3 RA11.6)
PRG2_PRU1_GP6: 20-RGMII ETHERNET PHY - ICSSG PRG2_PRU0 (RA2.3), 28-MIPI 60 PIN CONNECTOR (RA5.2 RA11.7)
PRG2_PRU1_GP7: 20-RGMII ETHERNET PHY - ICSSG PRG2_PRU0 (U34.AE15), 28-MIPI 60 PIN CONNECTOR (RA5.1 RA11.8)
PRG2_PRU1_GP8: 20-RGMII ETHERNET PHY - ICSSG PRG2_PRU0 (RA2.4), 28-MIPI 60 PIN CONNECTOR (RA1.8 RA9.1)
PRG2_PRU1_GP9: 20-RGMII ETHERNET PHY - ICSSG PRG2_PRU0 (R494.2), 28-MIPI 60 PIN CONNECTOR (RA1.7 RA9.2)
PRG2_PRU1_GP10: 20-RGMII ETHERNET PHY - ICSSG PRG2_PRU0 (R500.2), 28-MIPI 60 PIN CONNECTOR (RA1.6 RA9.3)
PRG2_PRU1_GP11: 20-RGMII ETHERNET PHY - ICSSG PRG2_PRU0 (RA2.1), 28-MIPI 60 PIN CONNECTOR (R180.1 R463.1)
PRG2_PRU1_GP16: 20-RGMII ETHERNET PHY - ICSSG PRG2_PRU0 (RA2.2), 28-MIPI 60 PIN CONNECTOR (R183.1 R466.1)
PRG2_RGMII1_ETH1_CLK: 20-RGMII ETHERNET PHY - ICSSG PRG2_PRU0 (U31.15), 36-ETHERNET PHY CLOCK GENERATOR (R170.2)
PRG2_RGMII1_RD0: 20-RGMII ETHERNET PHY - ICSSG PRG2_PRU0 (R168.1), 28-MIPI 60 PIN CONNECTOR (RA1.13)
PRG2_RGMII1_RD1: 20-RGMII ETHERNET PHY - ICSSG PRG2_PRU0 (R162.1), 28-MIPI 60 PIN CONNECTOR (RA1.12)
PRG2_RGMII1_RD2: 20-RGMII ETHERNET PHY - ICSSG PRG2_PRU0 (R157.1), 28-MIPI 60 PIN CONNECTOR (RA1.14)
PRG2_RGMII1_RD3: 20-RGMII ETHERNET PHY - ICSSG PRG2_PRU0 (R154.1), 28-MIPI 60 PIN CONNECTOR (RA1.15)
PRG2_RGMII1_RX_CTL: 20-RGMII ETHERNET PHY - ICSSG PRG2_PRU0 (R152.1), 28-MIPI 60 PIN CONNECTOR (RA1.16)
PRG2_RGMII1_RXC: 20-RGMII ETHERNET PHY - ICSSG PRG2_PRU0 (R181.1), 28-MIPI 60 PIN CONNECTOR (RA3.9)
PRG2_RGMII1_TD0: 20-RGMII ETHERNET PHY - ICSSG PRG2_PRU0 (U31.28), 28-MIPI 60 PIN CONNECTOR (RA3.12)
PRG2_RGMII1_TD1: 20-RGMII ETHERNET PHY - ICSSG PRG2_PRU0 (U31.27), 28-MIPI 60 PIN CONNECTOR (RA3.13)
PRG2_RGMII1_TD2: 20-RGMII ETHERNET PHY - ICSSG PRG2_PRU0 (U31.26), 28-MIPI 60 PIN CONNECTOR (RA3.14)
PRG2_RGMII1_TD3: 20-RGMII ETHERNET PHY - ICSSG PRG2_PRU0 (U31.25), 28-MIPI 60 PIN CONNECTOR (RA3.15)
PRG2_RGMII1_TX_CTL: 20-RGMII ETHERNET PHY - ICSSG PRG2_PRU0 (U31.37), 28-MIPI 60 PIN CONNECTOR (RA3.10)
PRG2_RGMII1_TXC: 20-RGMII ETHERNET PHY - ICSSG PRG2_PRU0 (U31.29), 28-MIPI 60 PIN CONNECTOR (RA3.16)
PRG2_RGMII2_ETH2_CLK: 21-RGMII ETHERNET PHY - ICSSG PRG2_PRU1 (U88.15), 36-ETHERNET PHY CLOCK GENERATOR (R169.2)
PRG2_RGMII2_RD0: 21-RGMII ETHERNET PHY - ICSSG PRG2_PRU1 (R519.1), 28-MIPI 60 PIN CONNECTOR (RA5.9)
PRG2_RGMII2_RD1: 21-RGMII ETHERNET PHY - ICSSG PRG2_PRU1 (R523.1), 28-MIPI 60 PIN CONNECTOR (RA5.10)
PRG2_RGMII2_RD2: 21-RGMII ETHERNET PHY - ICSSG PRG2_PRU1 (R525.1), 28-MIPI 60 PIN CONNECTOR (RA5.11)
PRG2_RGMII2_RD3: 21-RGMII ETHERNET PHY - ICSSG PRG2_PRU1 (R537.1), 28-MIPI 60 PIN CONNECTOR (RA5.12)
PRG2_RGMII2_RX_CTL: 21-RGMII ETHERNET PHY - ICSSG PRG2_PRU1 (R541.1), 28-MIPI 60 PIN CONNECTOR (RA5.13)
PRG2_RGMII2_RXC: 21-RGMII ETHERNET PHY - ICSSG PRG2_PRU1 (R517.1), 28-MIPI 60 PIN CONNECTOR (RA5.14)
PRG2_RGMII2_TD0: 21-RGMII ETHERNET PHY - ICSSG PRG2_PRU1 (U88.28), 28-MIPI 60 PIN CONNECTOR (RA1.9)
PRG2_RGMII2_TD1: 21-RGMII ETHERNET PHY - ICSSG PRG2_PRU1 (U88.27), 28-MIPI 60 PIN CONNECTOR (RA1.10)
PRG2_RGMII2_TD2: 21-RGMII ETHERNET PHY - ICSSG PRG2_PRU1 (U88.26), 28-MIPI 60 PIN CONNECTOR (RA1.11)
PRG2_RGMII2_TD3: 21-RGMII ETHERNET PHY - ICSSG PRG2_PRU1 (U88.25), 28-MIPI 60 PIN CONNECTOR (R180.2)
PRG2_RGMII2_TX_CTL: 21-RGMII ETHERNET PHY - ICSSG PRG2_PRU1 (U88.37), 28-MIPI 60 PIN CONNECTOR (RA5.15)
PRG2_RGMII2_TXC: 21-RGMII ETHERNET PHY - ICSSG PRG2_PRU1 (U88.29), 28-MIPI 60 PIN CONNECTOR (R183.2)
PRG2_RGMII_INTn: 20-RGMII ETHERNET PHY - ICSSG PRG2_PRU0 (R151.1 U31.44), 21-RGMII ETHERNET PHY - ICSSG PRG2_PRU1 (R542.1 U88.44), 38-TEST HEADER (U45.5)
PRG2_RGMII_INTn_3V3: 33-SOC_GENERAL AND MCU GENERAL (U34.A22), 38-TEST HEADER (R270.1 U45.8)
PRG2_RGMII_RESETn: 20-RGMII ETHERNET PHY - ICSSG PRG2_PRU0 (R514.1 U31.43 U86.4), 21-RGMII ETHERNET PHY - ICSSG PRG2_PRU1 (U88.43)
RESET_SoC_MPU: 37-ETHERNET LEDs (U110.12), 41-SoC POWER SUPPLY (C682.1 U59.D1)
SEL_XDS110_INV: 27-JTAG BUFFER (7 pins), 28-MIPI 60 PIN CONNECTOR (7 pins)
SERDES_BRD_DET: 19-EEPROM,PRESENCE DETECTION & TEMP SENSOR (R236.1 U46.6), 34-SERDES AND DISPLAY INTERFACE (J5.45)
SoC_EMU0: 27-JTAG BUFFER (U87.5 U103.5), 33-SOC_GENERAL AND MCU GENERAL (U34.AA2)
SoC_EMU1: 27-JTAG BUFFER (U87.4 U103.4), 33-SOC_GENERAL AND MCU GENERAL (U34.AA1)
SOC_I2C0_SCL: 10-SoC CLOCK AND RESET (U91.6), 32-APPLICATION BOARD CONNECTOR (J16.21), 33-SOC_GENERAL AND MCU GENERAL (R586.2 U34.D20), 37-ETHERNET LEDs (U84.15 U110.19), 38-TEST HEADER (J33.3)
SOC_I2C0_SDA: 10-SoC CLOCK AND RESET (U91.5), 32-APPLICATION BOARD CONNECTOR (J16.23), 33-SOC_GENERAL AND MCU GENERAL (R585.2 U34.C21), 37-ETHERNET LEDs (U84.2 U110.20), 38-TEST HEADER (J33.2)
SOC_I2C1_SCL: 33-SOC_GENERAL AND MCU GENERAL (J44.3 R581.2 TP67.1 U34.B21), 34-SERDES AND DISPLAY INTERFACE (J38.26)
SOC_I2C1_SDA: 33-SOC_GENERAL AND MCU GENERAL (J45.3 R582.2 TP68.1 U34.E21), 34-SERDES AND DISPLAY INTERFACE (J38.27)
SoC_I2C2_SCL: 19-EEPROM,PRESENCE DETECTION & TEMP SENSOR (TP73.1 U44.1 U89.1), 23-TEST AUTOMATION (J41.36), 25-CURRENT MONITORING DEVICES (12 pins), 35-CSI-GPM-CDSS INTERFACE (U34.T27)
SoC_I2C2_SDA: 19-EEPROM,PRESENCE DETECTION & TEMP SENSOR (TP74.1 U44.6 U89.6), 23-TEST AUTOMATION (J41.38), 25-CURRENT MONITORING DEVICES (12 pins), 35-CSI-GPM-CDSS INTERFACE (U34.R25)
SOC_MAIN_UART0_CTS_3V3: 30-FT4232 LEVEL TRANSLATOR (U19.9), 33-SOC_GENERAL AND MCU GENERAL (U34.AG11)
SOC_MAIN_UART0_RTS_3V3: 30-FT4232 LEVEL TRANSLATOR (U19.7), 33-SOC_GENERAL AND MCU GENERAL (U34.AD11)
SOC_MAIN_UART0_RX_3V3: 30-FT4232 LEVEL TRANSLATOR (U19.8), 33-SOC_GENERAL AND MCU GENERAL (U34.AF11)
SOC_MAIN_UART0_TX_3V3: 30-FT4232 LEVEL TRANSLATOR (U19.6), 33-SOC_GENERAL AND MCU GENERAL (U34.AE11)
SOC_MAIN_UART1_RX_1V8: 30-FT4232 LEVEL TRANSLATOR (U26.7), 32-APPLICATION BOARD CONNECTOR (U34.AE23)
SOC_MAIN_UART1_TX_1V8: 30-FT4232 LEVEL TRANSLATOR (U26.4), 32-APPLICATION BOARD CONNECTOR (U34.AD23)
SOC_MCU_SCL: 19-EEPROM,PRESENCE DETECTION & TEMP SENSOR (U9.6), 33-SOC_GENERAL AND MCU GENERAL (J44.2 R545.2 TP69.1), 34-SERDES AND DISPLAY INTERFACE (J5.2), 35-CSI-GPM-CDSS INTERFACE (J35.32 J36.32 U111.20)
SOC_MCU_SDA: 19-EEPROM,PRESENCE DETECTION & TEMP SENSOR (U9.5), 33-SOC_GENERAL AND MCU GENERAL (J45.2 R538.2 TP70.1), 34-SERDES AND DISPLAY INTERFACE (J5.3), 35-CSI-GPM-CDSS INTERFACE (J35.34 J36.34 U111.18)
SOC_MCU_UART1_CTS_1V8: 18-OSPI FLASH AND SPI NOR FLASH (U34.P1), 30-FT4232 LEVEL TRANSLATOR (U8.5)
SOC_MCU_UART1_RTS_1V8: 18-OSPI FLASH AND SPI NOR FLASH (U34.N3), 30-FT4232 LEVEL TRANSLATOR (U6.7 U12.7)
SOC_MCU_UART1_RX_1V8: 18-OSPI FLASH AND SPI NOR FLASH (U34.P4), 30-FT4232 LEVEL TRANSLATOR (U65.5)
SOC_MCU_UART1_TX_1V8: 18-OSPI FLASH AND SPI NOR FLASH (U34.P5), 30-FT4232 LEVEL TRANSLATOR (U6.6 U12.6)
SoC_PORz: 33-SOC_GENERAL AND MCU GENERAL (R427.1 U34.E19 U34.W5), 34-SERDES AND DISPLAY INTERFACE (R743.2), 39-VOLTAGE SUPERVISOR AND WKUP LEDs (R299.2 TP28.1)
SOC_SERDES_REFCLK0_N: 29-USB 2.0 INTERFACE (U34.AG5), 34-SERDES AND DISPLAY INTERFACE (J5.24)
SOC_SERDES_REFCLK0_P: 29-USB 2.0 INTERFACE (U34.AG6), 34-SERDES AND DISPLAY INTERFACE (J5.25)
SOC_SPI0_CLK: 18-OSPI FLASH AND SPI NOR FLASH (R136.1 U24.B2), 32-APPLICATION BOARD CONNECTOR (J16.20), 33-SOC_GENERAL AND MCU GENERAL (R491.1)
SOC_SPI0_CS0: 18-OSPI FLASH AND SPI NOR FLASH (R133.1 U24.C2), 33-SOC_GENERAL AND MCU GENERAL (U34.AG13)
SOC_SPI0_CS1: 32-APPLICATION BOARD CONNECTOR (J16.24), 33-SOC_GENERAL AND MCU GENERAL (U34.AF13)
SOC_SPI0_D0: 18-OSPI FLASH AND SPI NOR FLASH (R123.1 U24.D3), 32-APPLICATION BOARD CONNECTOR (J16.26), 33-SOC_GENERAL AND MCU GENERAL (U34.AE13)
SOC_SPI0_D1: 18-OSPI FLASH AND SPI NOR FLASH (R126.1 U24.D2), 32-APPLICATION BOARD CONNECTOR (J16.28), 33-SOC_GENERAL AND MCU GENERAL (U34.AD13)
SOC_SPI1_CLK: 33-SOC_GENERAL AND MCU GENERAL (R489.1), 34-SERDES AND DISPLAY INTERFACE (J38.32), 35-CSI-GPM-CDSS INTERFACE (J35.48 J36.48), 38-TEST HEADER (J20.4)
SOC_SPI1_CS0: 33-SOC_GENERAL AND MCU GENERAL (U34.AD12), 34-SERDES AND DISPLAY INTERFACE (R675.1), 38-TEST HEADER (R317.2)
SOC_SPI1_CS1: 33-SOC_GENERAL AND MCU GENERAL (U34.AG12), 35-CSI-GPM-CDSS INTERFACE (R311.1), 38-TEST HEADER (R316.2)
SOC_SPI1_MISO: 33-SOC_GENERAL AND MCU GENERAL (U34.AF12), 34-SERDES AND DISPLAY INTERFACE (J38.36), 35-CSI-GPM-CDSS INTERFACE (J35.46 J36.46), 38-TEST HEADER (J20.2)
SOC_SPI1_MOSI: 33-SOC_GENERAL AND MCU GENERAL (U34.AE12), 34-SERDES AND DISPLAY INTERFACE (J38.35), 35-CSI-GPM-CDSS INTERFACE (J35.44 J36.44), 38-TEST HEADER (J20.1)
SoC_TCK: 27-JTAG BUFFER (R241.2 R623.2), 33-SOC_GENERAL AND MCU GENERAL (U34.AA4)
SoC_TDI: 27-JTAG BUFFER (U43.4 U98.4), 33-SOC_GENERAL AND MCU GENERAL (U34.C20)
SoC_TDO: 27-JTAG BUFFER (U97.2 U101.2), 33-SOC_GENERAL AND MCU GENERAL (R208.2)
SoC_TMS: 27-JTAG BUFFER (U43.6 U98.6), 33-SOC_GENERAL AND MCU GENERAL (U34.A21)
SoC_TRST#: 27-JTAG BUFFER (R130.1 U43.7 U98.7), 33-SOC_GENERAL AND MCU GENERAL (U34.AA3)
SOC_UART1_CTS_1V8: 30-FT4232 LEVEL TRANSLATOR (U26.12), 32-APPLICATION BOARD CONNECTOR (U34.AD22)
SOC_UART1_RTS_1V8: 30-FT4232 LEVEL TRANSLATOR (U26.9), 32-APPLICATION BOARD CONNECTOR (U34.AC21)
SoC_WARM_RESETZ: 10-SoC CLOCK AND RESET (R309.1 U55.4), 33-SOC_GENERAL AND MCU GENERAL (U34.F17)
SOC_WKUP_SCL: 19-EEPROM,PRESENCE DETECTION & TEMP SENSOR (U7.14 U46.14 U56.6), 32-APPLICATION BOARD CONNECTOR (J16.15), 33-SOC_GENERAL AND MCU GENERAL (R584.2 TP71.1 U34.AC7), 34-SERDES AND DISPLAY INTERFACE (J5.33 J38.23), 35-CSI-GPM-CDSS INTERFACE (J35.6 J36.6), 41-SoC POWER SUPPLY (U59.D3)
SOC_WKUP_SDA: 19-EEPROM,PRESENCE DETECTION & TEMP SENSOR (U7.15 U46.15 U56.5), 32-APPLICATION BOARD CONNECTOR (J16.17), 33-SOC_GENERAL AND MCU GENERAL (R583.2 TP72.1 U34.AD6), 34-SERDES AND DISPLAY INTERFACE (J5.34 J38.24), 35-CSI-GPM-CDSS INTERFACE (J35.14 J36.14), 41-SoC POWER SUPPLY (U59.D2)
SOC_WKUP_UART0_CTS_3V3: 30-FT4232 LEVEL TRANSLATOR (U23.5), 33-SOC_GENERAL AND MCU GENERAL (U34.AC2)
SOC_WKUP_UART0_RTS_3V3: 30-FT4232 LEVEL TRANSLATOR (U21.7), 33-SOC_GENERAL AND MCU GENERAL (U34.AC1), 38-TEST HEADER (J11.2)
SOC_WKUP_UART0_RX_3V3: 30-FT4232 LEVEL TRANSLATOR (U83.5), 33-SOC_GENERAL AND MCU GENERAL (U34.AB1)
SOC_WKUP_UART0_TX_3V3: 30-FT4232 LEVEL TRANSLATOR (U21.6), 33-SOC_GENERAL AND MCU GENERAL (U34.AB5), 38-TEST HEADER (J11.5)
SUPERVISOR_DEBOUNCE_RSTn: 23-TEST AUTOMATION (U54.1), 39-VOLTAGE SUPERVISOR AND WKUP LEDs (6 pins)
SUPERVISOR_MR_RSTn: 23-TEST AUTOMATION (U54.7), 39-VOLTAGE SUPERVISOR AND WKUP LEDs (U49.1)
TEST_GPIO1: 10-SoC CLOCK AND RESET (U53.1), 23-TEST AUTOMATION (R683.1 R692.1)
TEST_GPIO2: 10-SoC CLOCK AND RESET (U104.1), 23-TEST AUTOMATION (R684.1 R693.1)
TEST_GPIO3: 23-TEST AUTOMATION (R694.1), 24-BOOT MODE BUFFER AND SWITCHES (R66.1 U17.1)
TEST_GPIO4: 23-TEST AUTOMATION (R685.1 R695.1 TP65.1), 24-BOOT MODE BUFFER AND SWITCHES (U99.28)
TEST_PORZn: 23-TEST AUTOMATION (R681.1 R690.1), 39-VOLTAGE SUPERVISOR AND WKUP LEDs (Q7.1)
TEST_POWERDOWN: 23-TEST AUTOMATION (R689.1), 43-OVER VOLTAGE PROTECTION CKT (R352.2 U66.5)
TEST_WARMRESETn: 10-SoC CLOCK AND RESET (U55.1), 23-TEST AUTOMATION (R682.1 R691.1)
TIMER_IO0: 33-SOC_GENERAL AND MCU GENERAL (U34.B22), 38-TEST HEADER (J19.1)
TIMER_IO1: 33-SOC_GENERAL AND MCU GENERAL (U34.C23), 38-TEST HEADER (J19.2)
TIMER_IO2: 35-CSI-GPM-CDSS INTERFACE (RA6.1), 38-TEST HEADER (J19.3)
TIMER_IO3: 35-CSI-GPM-CDSS INTERFACE (RA6.2), 38-TEST HEADER (J19.4)
TIMER_IO6: 35-CSI-GPM-CDSS INTERFACE (RA6.3), 38-TEST HEADER (J19.5)
TIMER_IO7: 35-CSI-GPM-CDSS INTERFACE (RA6.4), 38-TEST HEADER (J19.6)
USB0_DM: 29-USB 2.0 INTERFACE (U34.AE2), 34-SERDES AND DISPLAY INTERFACE (J5.36)
USB0_DP: 29-USB 2.0 INTERFACE (U34.AF1), 34-SERDES AND DISPLAY INTERFACE (J5.37)
USB0_DRV_VBUS: 29-USB 2.0 INTERFACE (U34.AD9), 34-SERDES AND DISPLAY INTERFACE (J5.5)
USB0_ID_SOC: 29-USB 2.0 INTERFACE (U34.AF7), 34-SERDES AND DISPLAY INTERFACE (J5.14)
USB0_PCIE0_SGMII0_RXN0: 29-USB 2.0 INTERFACE (U34.AH3), 34-SERDES AND DISPLAY INTERFACE (J5.40)
USB0_PCIE0_SGMII0_RXP0: 29-USB 2.0 INTERFACE (U34.AG2), 34-SERDES AND DISPLAY INTERFACE (J5.39)
USB0_PCIE0_SGMII0_TXN0: 29-USB 2.0 INTERFACE (C60.2), 34-SERDES AND DISPLAY INTERFACE (J5.43)
USB0_PCIE0_SGMII0_TXP0: 29-USB 2.0 INTERFACE (C61.2), 34-SERDES AND DISPLAY INTERFACE (J5.42)
USB0_VBUS: 29-USB 2.0 INTERFACE (R380.1), 34-SERDES AND DISPLAY INTERFACE (C691.1 J5.47)
USB1_HDMI_GPMC_DM: 29-USB 2.0 INTERFACE (R74.1), 35-CSI-GPM-CDSS INTERFACE (J35.52 J36.52)
USB1_HDMI_GPMC_DP: 29-USB 2.0 INTERFACE (R76.1), 35-CSI-GPM-CDSS INTERFACE (J35.54 J36.54)
USB1_HDMI_GPMC_DRVBUS: 29-USB 2.0 INTERFACE (R474.1), 35-CSI-GPM-CDSS INTERFACE (J35.50 J36.50)
VCC3V3_PREREG_PG: 40-PRE_REG AND SERDES POWER SUPPLY (C316.1 R376.1 U75.24), 42-PERIPHERAL POWER SUPPLY (TP83.1 U5.4 U40.6 U80.8)
VIN_MON_PORz_3V3_PG: 39-VOLTAGE SUPERVISOR AND WKUP LEDs (R210.2 U35.1 U50.3), 41-SoC POWER SUPPLY (TP76.1 U60.4 U63.6 U94.1), 42-PERIPHERAL POWER SUPPLY (C353.1 R401.2 U80.10)
VOUT_D0_BOOTMODE0: 24-BOOT MODE BUFFER AND SWITCHES (R297.1 R631.1 SW3.1), 35-CSI-GPM-CDSS INTERFACE (J35.51 J36.51 U34.M27)
VOUT_D1_BOOTMODE1: 24-BOOT MODE BUFFER AND SWITCHES (R293.1 R626.1 SW3.2), 35-CSI-GPM-CDSS INTERFACE (J35.49 J36.49 U34.M23)
VOUT_D2_BOOTMODE2: 24-BOOT MODE BUFFER AND SWITCHES (R287.1 R632.1 SW3.3), 35-CSI-GPM-CDSS INTERFACE (J35.47 J36.47 U34.M28)
VOUT_D3_BOOTMODE3: 24-BOOT MODE BUFFER AND SWITCHES (R282.1 R627.1 SW3.4), 35-CSI-GPM-CDSS INTERFACE (J35.45 J36.45 U34.M24)
VOUT_D4_BOOTMODE4: 24-BOOT MODE BUFFER AND SWITCHES (R278.1 R633.1 SW3.5), 35-CSI-GPM-CDSS INTERFACE (J35.43 J36.43 U34.N24)
VOUT_D5_BOOTMODE5: 24-BOOT MODE BUFFER AND SWITCHES (R274.1 R628.1 SW3.6), 35-CSI-GPM-CDSS INTERFACE (J35.41 J36.41 U34.N27)
VOUT_D6_BOOTMODE6: 24-BOOT MODE BUFFER AND SWITCHES (R260.1 R629.1 SW3.7), 35-CSI-GPM-CDSS INTERFACE (J35.39 J36.39 U34.N28)
VOUT_D7_BOOTMODE7: 24-BOOT MODE BUFFER AND SWITCHES (R251.1 R634.1 SW3.8), 35-CSI-GPM-CDSS INTERFACE (J35.37 J36.37 U34.M25)
VOUT_D8_BOOTMODE8: 24-BOOT MODE BUFFER AND SWITCHES (R245.1 R642.1 SW3.9), 35-CSI-GPM-CDSS INTERFACE (J35.33 J36.33 U34.N23)
VOUT_D9_BOOTMODE9: 24-BOOT MODE BUFFER AND SWITCHES (R240.1 R635.1 SW3.10), 35-CSI-GPM-CDSS INTERFACE (J35.31 J36.31 U34.M26)
VOUT_D10_BOOTMODE10: 24-BOOT MODE BUFFER AND SWITCHES (R295.1 R643.1 SW2.1), 35-CSI-GPM-CDSS INTERFACE (J35.29 J36.29 U34.P28)
VOUT_D11_BOOTMODE11: 24-BOOT MODE BUFFER AND SWITCHES (R291.1 R636.1 SW2.2), 35-CSI-GPM-CDSS INTERFACE (J35.27 J36.27 U34.P27)
VOUT_D12_BOOTMODE12: 24-BOOT MODE BUFFER AND SWITCHES (R285.1 R644.1 SW2.3), 35-CSI-GPM-CDSS INTERFACE (J35.25 J36.25 U34.N26)
VOUT_D13_BOOTMODE13: 24-BOOT MODE BUFFER AND SWITCHES (R280.1 R637.1 SW2.4), 35-CSI-GPM-CDSS INTERFACE (J35.23 J36.23 U34.N25)
VOUT_D14_BOOTMODE14: 24-BOOT MODE BUFFER AND SWITCHES (R276.1 R638.1 SW2.5), 35-CSI-GPM-CDSS INTERFACE (J35.21 J36.21 U34.P24)
VOUT_D15_BOOTMODE15: 24-BOOT MODE BUFFER AND SWITCHES (R272.1 R645.1 SW2.6), 35-CSI-GPM-CDSS INTERFACE (J35.19 J36.19 U34.R27)
VOUT_D17_BOOTMODE16: 24-BOOT MODE BUFFER AND SWITCHES (R258.1 R603.1 SW2.7), 35-CSI-GPM-CDSS INTERFACE (J35.13 J36.13 U34.P25)
VOUT_D18_BOOTMODE17: 24-BOOT MODE BUFFER AND SWITCHES (R249.1 R602.1 SW2.8), 35-CSI-GPM-CDSS INTERFACE (J35.11 J36.11 U34.P26)
VOUT_D19_BOOTMODE18: 24-BOOT MODE BUFFER AND SWITCHES (R243.1 R601.1 SW2.9), 35-CSI-GPM-CDSS INTERFACE (J35.9 J36.9 U34.U28)
VPP_LDO_EN: 18-OSPI FLASH AND SPI NOR FLASH (U34.R1), 41-SoC POWER SUPPLY (R6.2 TP80.1 U1.3)
WKUP_GPIO0_13_INTn: 10-SoC CLOCK AND RESET (R308.1 U53.4), 18-OSPI FLASH AND SPI NOR FLASH (U34.R5)
WKUP_GPIO0_27_INTn: 10-SoC CLOCK AND RESET (R647.1 U104.4), 18-OSPI FLASH AND SPI NOR FLASH (U34.P2)
WKUP_LFOSC_RTC_XIN: 10-SoC CLOCK AND RESET (R551.2), 33-SOC_GENERAL AND MCU GENERAL (U34.AE4)
WKUP_OSC0_XIN: 10-SoC CLOCK AND RESET (R450.1), 33-SOC_GENERAL AND MCU GENERAL (U34.AD5), 36-ETHERNET PHY CLOCK GENERATOR (R448.2)
WKUP_OSC0_XOUT: 10-SoC CLOCK AND RESET (R457.1), 33-SOC_GENERAL AND MCU GENERAL (U34.AE6)
WKUP_UART_SEL: 30-FT4232 LEVEL TRANSLATOR (R120.2 U23.6 U83.6), 37-ETHERNET LEDs (U110.14)
XDS110_EMU0: 26-XDS110 DEBUGGER (R655.2 U106.42), 27-JTAG BUFFER (U103.8)
XDS110_EMU1: 26-XDS110 DEBUGGER (R654.2 U106.43), 27-JTAG BUFFER (U103.1)
XDS110_TCK: 26-XDS110 DEBUGGER (R609.2), 27-JTAG BUFFER (U98.12)
XDS110_TDI: 26-XDS110 DEBUGGER (R612.2), 27-JTAG BUFFER (U98.13)
XDS110_TDO: 26-XDS110 DEBUGGER (R611.2), 27-JTAG BUFFER (U97.7)
XDS110_TMS: 26-XDS110 DEBUGGER (R613.2), 27-JTAG BUFFER (U98.11)
XDS110_TRST#: 26-XDS110 DEBUGGER (R646.2), 27-JTAG BUFFER (U98.10)